# Altium schematic sheet Pre-CHG_switch.SchDoc
size A4
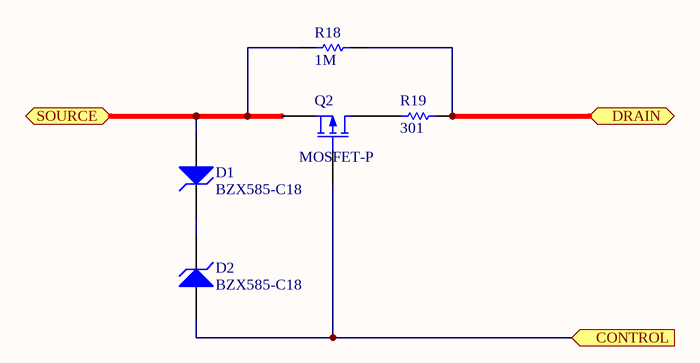
[diagram p0: Pre-CHG_switch.SchDoc]

## Parts
D1  BZX585-C18  [DIODE-0.7]
D2  BZX585-C18  [DIODE-0.7]
Q2  MOSFET-P  [E3]
R18  1M  [AXIAL-0.3]
R19  301  [AXIAL-0.3]

## Ports
CONTROL (in), DRAIN (bidir), SOURCE (bidir)

## Nets
CONTROL: D2.1(A) Q2.2(G) ; port CONTROL
DRAIN: R18.2 R19.2 ; port DRAIN
SOURCE: D1.1(A) Q2.3(S) R18.1 ; port SOURCE
NetD1_2: D1.2(K) D2.2(K)
NetQ2_1: Q2.1(D) R19.1

## Library data of the parts
D1 D2 = D Zener: Zener Diode; Published: 8-Jun-2000; LatestRevisionDate: 17-Jul-2002; LatestRevisionNote: Re-released for DXP Platform.; PackageReference: DIODE-0.7; Publisher: Altium Limited; PackageDescription: Diode, Thru-Hole; 2 Leads; 0.7 in Pin Spacing
Q2 = MOSFET-P: SI4435DDY; Published: 8-Jun-2000; LatestRevisionDate: 17-Jul-2002; LatestRevisionNote: Re-released for DXP Platform.; PackageVersion: 1995/1996; PackageReference: E3; Publisher: Altium Limited; PackageDescription: TO, Flat Index; 3 In-Line, Axial Leads; Body Dia. 4.6mm; Lead Dia. 0.5 mm (max)
R18 = Res1: Resistor; Published: 8-Jun-2000; LatestRevisionDate: 17-Jul-2002; LatestRevisionNote: Re-released for DXP Platform.; PackageReference: AXIAL-0.3; Publisher: Altium Limited; PackageDescription: Axial Device, Thru-Hole; 2 Leads; 0.3 in Pin Spacing; Value: 1M
R19 = Res1: Resistor 1W; Published: 8-Jun-2000; LatestRevisionDate: 17-Jul-2002; LatestRevisionNote: Re-released for DXP Platform.; PackageReference: AXIAL-0.3; Publisher: Altium Limited; PackageDescription: Axial Device, Thru-Hole; 2 Leads; 0.3 in Pin Spacing; Value: 301